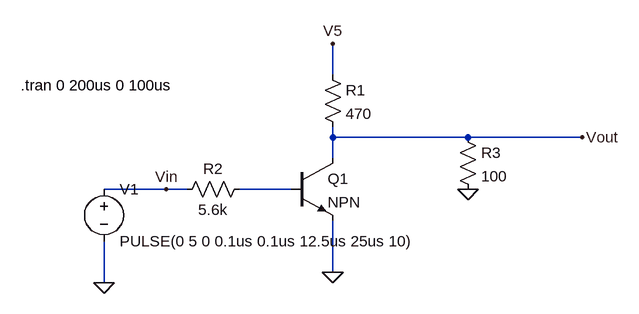
[diagram p0: schematic main.asc]
main.asc, the LTspice schematic file:
Version 4
SHEET 1 880 680
WIRE 240 32 240 -16
WIRE 240 128 240 112
WIRE 448 128 240 128
WIRE 624 128 448 128
WIRE 240 160 240 128
WIRE -16 208 -112 208
WIRE 16 208 -16 208
WIRE 176 208 96 208
WIRE 240 336 240 256
WIRE -112 352 -112 288
FLAG 240 336 0
FLAG -112 352 0
FLAG 624 128 Vout
FLAG -16 208 Vin
FLAG 448 208 0
FLAG 240 -16 V5
SYMBOL npn 176 160 R0
SYMATTR InstName Q1
SYMBOL res 224 16 R0
SYMATTR InstName R1
SYMATTR Value 470
SYMBOL voltage -112 192 R0
SYMATTR InstName V1
SYMATTR Value PULSE(0 5 0 0.1us 0.1us 12.5us 25us 10)
SYMBOL res 112 192 R90
WINDOW 0 0 56 VBottom 2
WINDOW 3 32 56 VTop 2
SYMATTR InstName R2
SYMATTR Value 5.6k
SYMBOL res 432 112 R0
SYMATTR InstName R3
SYMATTR Value 100
TEXT -240 48 Left 2 !.tran 0 200us 0 100us

The netlist it stands for:
* main.asc
Q1 Vout N001 0 0 NPN
R1 V5 Vout 470
V1 Vin 0 PULSE(0 5 0 0.1us 0.1us 12.5us 25us 10)
R2 N001 Vin 5.6k
R3 Vout 0 100
.model NPN NPN
.model PNP PNP
.lib standard.bjt
.tran 0 200us 0 100us
.backanno
.end